# EAGLE schematic VCO-8038 (EAGLE 7.2.0)
The 8038 Audio Generator Project An Accurate 20 Hz to 20 kHz Linearly Controlled Audio Generator using ICL8038 http://www.birthofasynth.com/Thomas_Henry/Pages/8038.html
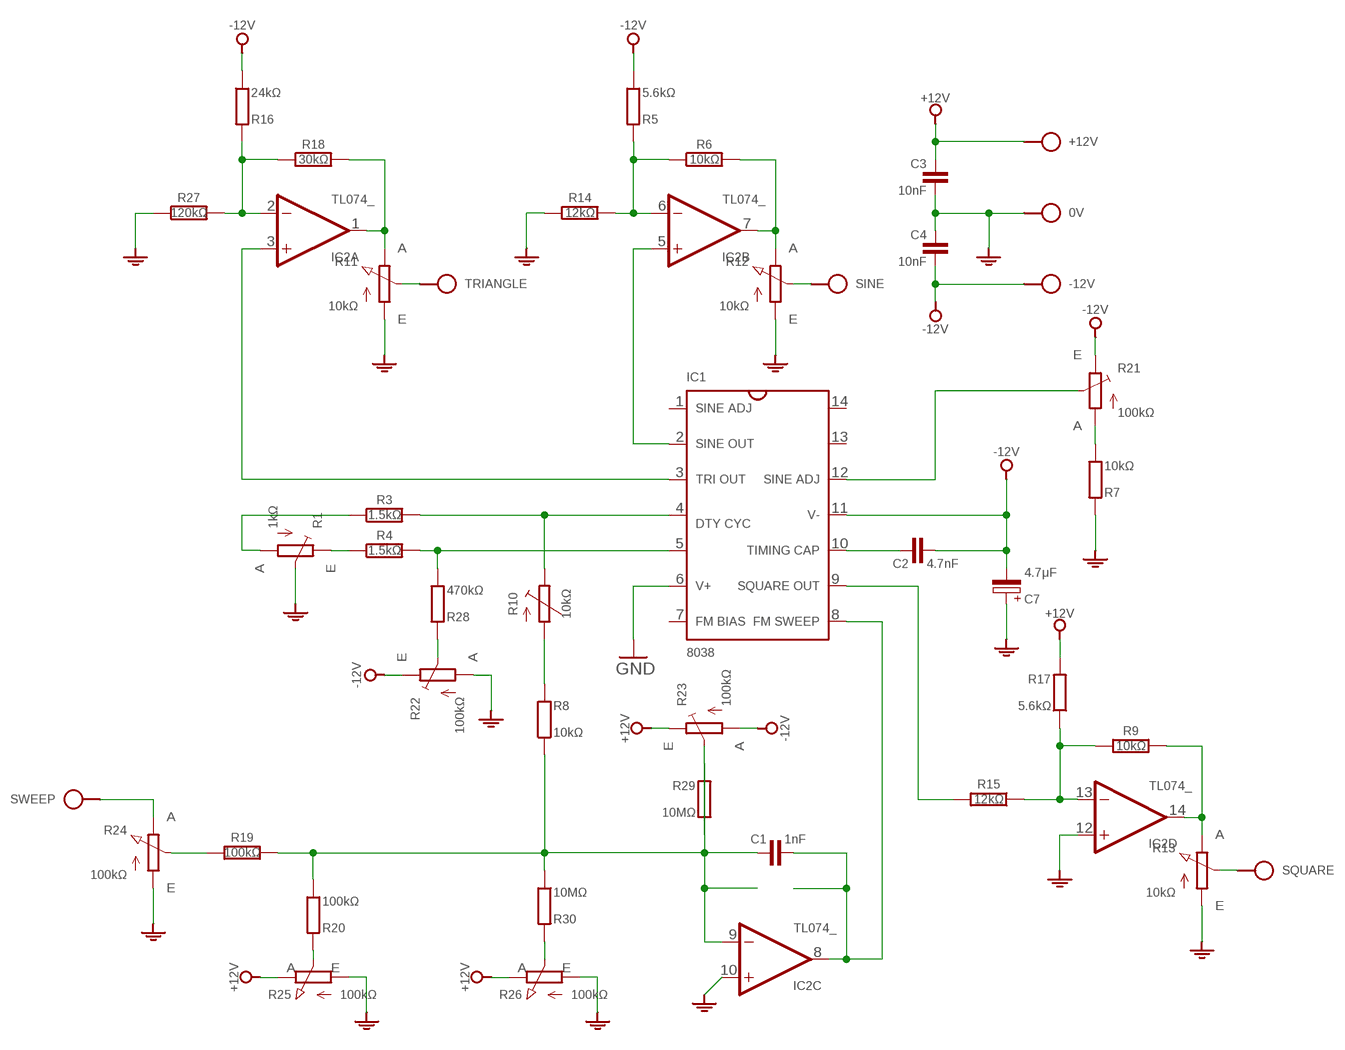
[diagram p0: schematic, sheet 1]

## Parts
0V  SPAD  [SPAD]
+12V  SPAD  [SPAD]
-12V  SPAD  [SPAD]
C1  1nF  C-H050-020X036/V  [C050-020X036/V]
C2  4.7nF  C-H050-020X036  [C050-020X036]
C3  10nF  C050-024X044  [C050-024X044]
C4  10nF  C050-020X036  [C050-020X036]
C7  4.7μF  CPOLE5-5/V  [E5-5/V]
IC1  8038  [DIL14]
IC2  TL074_  [DIL14]
R1  1kΩ  TRIMR-TRIM  [R-TRIM]
R3  1.5kΩ  R-H0204/10  [0204/10]
R4  1.5kΩ  R-H0204/10  [0204/10]
R5  5.6kΩ  R0204/10  [0204/10]
R6  10kΩ  R-H0204/10  [0204/10]
R7  10kΩ  R0204/7  [0204/7]
R8  10kΩ  R0204/10  [0204/10]
R9  10kΩ  R-H0204/10  [0204/10]
R10  10kΩ  TRIM-2R-TRIM-2  [R-TRIM]
R11  10kΩ  POT  [POT]
R12  10kΩ  POT  [POT]
R13  10kΩ  POT  [POT]
R14  12kΩ  R-H0204/10  [0204/10]
R15  12kΩ  R-H0204/10  [0204/10]
R16  24kΩ  R0204/10  [0204/10]
R17  5.6kΩ  R0204/10  [0204/10]
R18  30kΩ  R-H0204/10  [0204/10]
R19  100kΩ  R-H0204/10  [0204/10]
R20  100kΩ  R0204/10  [0204/10]
R21  100kΩ  TRIMR-TRIM  [R-TRIM]
R22  100kΩ  TRIMR-TRIM  [R-TRIM]
R23  100kΩ  TRIMR-TRIM  [R-TRIM]
R24  100kΩ  POT  [POT]
R25  100kΩ  POT-H  [POT]
R26  100kΩ  POT-H  [POT]
R27  120kΩ  R-H0204/10  [0204/10]
R28  470kΩ  R0204/10  [0204/10]
R29  10MΩ  R0204/7  [0204/7]
R30  10MΩ  R0204/10  [0204/10]
SINE  SPAD  [SPAD]
SQUARE  SPAD  [SPAD]
SWEEP  SPAD  [SPAD]
TRIANGLE  SPAD  [SPAD]

## Nets
-12V: R5.2 R16.2
GND: 0V.1 C3.2 C4.1 C7.+ IC1.6(V+) IC2.10(C:+IN) IC2.12(D:+IN) R1.2(S) R7.1 R11.A R12.A R13.A R14.2 R22.1(A) R24.A R25.A R26.A R27.1
N$1: R23.2(S) R29.2
N$2: C1.2 IC1.8(FM_SWEEP) IC2.8(C:OUT)
N$3: C1.1 IC2.9(C:-IN) R8.2 R19.1 R20.2 R29.1 R30.2
N$4: R26.S R30.1
N$5: R20.1 R25.S
N$6: R19.2 R24.S
N$7: R24.E SWEEP.1
N$8: R8.1 R10.3
N$9: R7.2 R21.1(A)
N$10: R1.1(A) R3.1
N$11: R1.3(E) R4.1
N$12: IC1.4(DUTY_1) R3.2 R10.1 R10.2
N$13: IC2.2(A:-IN) R16.1 R18.1 R27.2
N$14: IC1.5(DUTY_2) R4.2 R28.2
N$15: IC2.1(A:OUT) R11.E R18.2
N$16: R11.S TRIANGLE.1
N$17: IC1.3(TRI_OUT) IC2.3(A:+IN)
N$19: IC2.7(B:OUT) R6.2 R12.E
N$20: R12.S SINE.1
N$21: IC1.2(SINE_OUT) IC2.5(B:+IN)
N$22: R22.2(S) R28.1
N$23: IC1.12(SINE_ADJ_2) R21.2(S)
N$24: C2.1 IC1.10(TIMING_CAP)
N$25: IC2.13(D:-IN) R9.2 R15.1 R17.2
N$26: IC2.14(D:OUT) R9.1 R13.E
N$27: R13.S SQUARE.1
N$28: IC2.6(B:-IN) R5.1 R6.1 R14.1
N$29: IC1.9(SQR_OUT) R15.2
V+: +12V.1 C3.1 R17.1 R23.3(E) R25.E R26.E ; supply symbol labelled +12V
V-: -12V.1 C2.2 C4.2 C7.- IC1.11(V-) R21.3(E) R22.3(E) R23.1(A) ; supply symbol labelled -12V
Unconnected: IC1.1(SINE_ADJ) IC1.7(FM_BIAS) IC1.13(NC_1) IC1.14(NC_2)

## Power pins joined to a net without a drawn wire
V+: IC2.4(V+)
V-: IC2.11(V-)

## Library data of the parts
0V +12V -12V SINE SQUARE SWEEP TRIANGLE = pad:SPAD
C1 C2 = c:C-H
C3 C4 = c:C: CAPACITOR, European symbol
C7 = c:CPOL: POLARIZED CAPACITOR, European symbol
IC1 = ic:*8038: Precision Waveform Generator/Voltage Controlled Oscillator https://www.intersil.com/content/dam/Intersil/documents/icl8/icl8038.pdf
IC2 = ic:TL074_
R1 R21-R23 = r:TRIM: POTENTIOMETER
R3 R4 R6 R9 R14 R15 R18 R19 R27 = r:R-H
R5 R7 R8 R16 R17 R20 R28-R30 = r:R: RESISTOR, European symbol
R10 = r:TRIM-2
R11-R13 R24 = r:POT
R25 R26 = r:POT-H